# Altium schematic sheet Output.SchDoc
size B
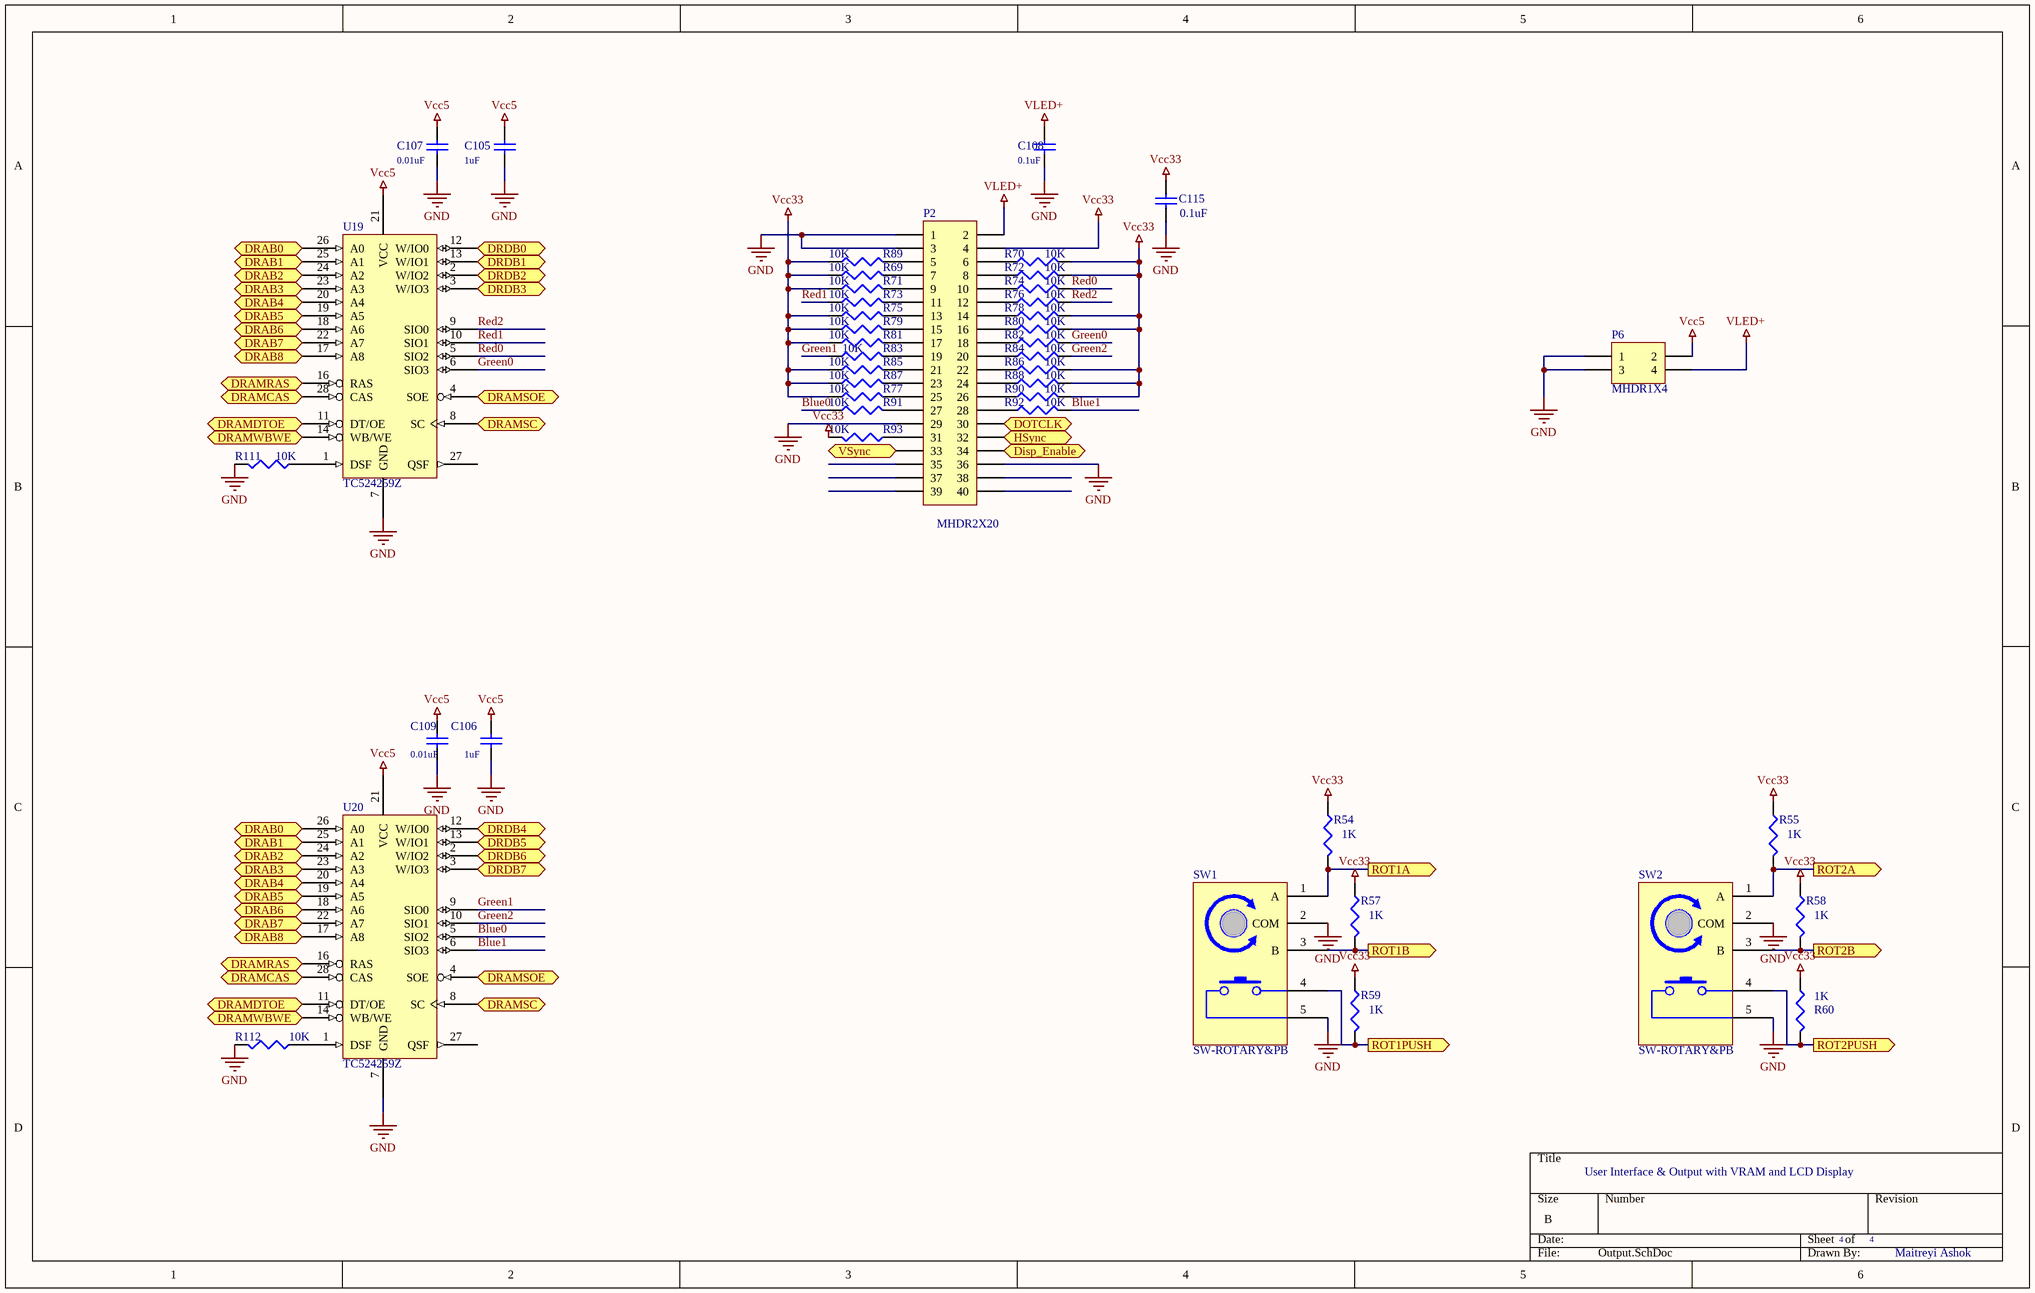
[diagram p0: Output.SchDoc]

## Parts
C105  value 1uF  [1608[0603]]  (hidden comment: Cap)
C106  value 1uF  [1608[0603]]  (hidden comment: Cap)
C107  value 0.01uF  [1608[0603]]  (hidden comment: Cap)
C108  value 0.1uF  [1608[0603]]  (hidden comment: Cap)
C109  value 0.01uF  [1608[0603]]  (hidden comment: Cap)
C115  value 0.1uF  [1608[0603]]  (hidden comment: Cap)
P2  MHDR2X20  [40PinZIF]
P6  MHDR1X4  [MDIN4]
R54  value 1K  [J1-0603]  (hidden comment: Res3)
R55  value 1K  [J1-0603]  (hidden comment: Res3)
R57  value 1K  [J1-0603]  (hidden comment: Res3)
R58  value 1K  [J1-0603]  (hidden comment: Res3)
R59  value 1K  [J1-0603]  (hidden comment: Res3)
R60  value 1K  [J1-0603]  (hidden comment: Res3)
R69  value 10K  [J1-0603]  (hidden comment: Res3)
R70  value 10K  [J1-0603]  (hidden comment: Res3)
R71  value 10K  [J1-0603]  (hidden comment: Res3)
R72  value 10K  [J1-0603]  (hidden comment: Res3)
R73  value 10K  [J1-0603]  (hidden comment: Res3)
R74  value 10K  [J1-0603]  (hidden comment: Res3)
R75  value 10K  [J1-0603]  (hidden comment: Res3)
R76  value 10K  [J1-0603]  (hidden comment: Res3)
R77  value 10K  [J1-0603]  (hidden comment: Res3)
R78  value 10K  [J1-0603]  (hidden comment: Res3)
R79  value 10K  [J1-0603]  (hidden comment: Res3)
R80  value 10K  [J1-0603]  (hidden comment: Res3)
R81  value 10K  [J1-0603]  (hidden comment: Res3)
R82  value 10K  [J1-0603]  (hidden comment: Res3)
R83  value 10K  [J1-0603]  (hidden comment: Res3)
R84  value 10K  [J1-0603]  (hidden comment: Res3)
R85  value 10K  [J1-0603]  (hidden comment: Res3)
R86  value 10K  [J1-0603]  (hidden comment: Res3)
R87  value 10K  [J1-0603]  (hidden comment: Res3)
R88  value 10K  [J1-0603]  (hidden comment: Res3)
R89  value 10K  [J1-0603]  (hidden comment: Res3)
R90  value 10K  [J1-0603]  (hidden comment: Res3)
R91  value 10K  [J1-0603]  (hidden comment: Res3)
R92  value 10K  [J1-0603]  (hidden comment: Res3)
R93  value 10K  [J1-0603]  (hidden comment: Res3)
R111  value 10K  [J1-0603]  (hidden comment: Res3)
R112  value 10K  [J1-0603]  (hidden comment: Res3)
SW1  SW-ROTARY&PB  [ROTENCPB]
SW2  SW-ROTARY&PB  [ROTENCPB]
U19  TC524259Z  [ZIPS28]
U20  TC524259Z  [ZIPS28]

## Ports
Disp_Enable (in), DOTCLK (in), DRAB0 (in), DRAB1 (in), DRAB2 (in), DRAB3 (in), DRAB4 (in), DRAB5 (in), DRAB6 (in), DRAB7 (in), DRAB8 (in), DRAMCAS (in), DRAMDTOE (in), DRAMRAS (in), DRAMSC (in), DRAMSOE (in), DRAMWBWE (in), DRDB0 (bidir), DRDB1 (bidir), DRDB2 (bidir), DRDB3 (bidir), DRDB4 (bidir), DRDB5 (bidir), DRDB6 (bidir), DRDB7 (bidir), HSync (in), ROT1A (out), ROT1B (out), ROT1PUSH (out), ROT2A (out), ROT2B (out), ROT2PUSH (out), VSync (in)

## Nets
GND: C105.1 C106.1 C107.1 C108.1 C109.1 C115.1 P2.1 P2.3 P2.29 P2.36 P6.1 P6.3 R111.2 R112.2 SW1.2(COM) SW1.5 SW2.2(COM) SW2.5 U19.7(GND) U20.7(GND)
VCC: C105.2 C106.2 C107.2 C109.2 P6.2 U19.21(VCC) U20.21(VCC)  [also labelled Vcc5]
Vcc33: C115.2 P2.4 R54.1 R55.1 R57.1 R58.1 R59.1 R60.1 R69.1 R70.2 R71.1 R72.2 R75.1 R77.1 R78.2 R79.1 R80.2 R81.1 R85.1 R86.2 R87.1 R88.2 R89.1 R90.2 R93.2
VLED+: C108.2 P2.2 P6.4
Blue0: R91.1 U20.5(SIO2)
Blue1: R92.2 U20.6(SIO3)
Disp_Enable: P2.34 ; port Disp_Enable
DOTCLK: P2.30 ; port DOTCLK
DRAB0: U19.26(A0) U20.26(A0) ; port DRAB0
DRAB1: U19.25(A1) U20.25(A1) ; port DRAB1
DRAB2: U19.24(A2) U20.24(A2) ; port DRAB2
DRAB3: U19.23(A3) U20.23(A3) ; port DRAB3
DRAB4: U19.20(A4) U20.20(A4) ; port DRAB4
DRAB5: U19.19(A5) U20.19(A5) ; port DRAB5
DRAB6: U19.18(A6) U20.18(A6) ; port DRAB6
DRAB7: U19.22(A7) U20.22(A7) ; port DRAB7
DRAB8: U19.17(A8) U20.17(A8) ; port DRAB8
DRAMCAS: U19.28(CAS) U20.28(CAS) ; port DRAMCAS
DRAMDTOE: U19.11(DT/OE) U20.11(DT/OE) ; port DRAMDTOE
DRAMRAS: U19.16(RAS) U20.16(RAS) ; port DRAMRAS
DRAMSC: U19.8(SC) U20.8(SC) ; port DRAMSC
DRAMSOE: U19.4(SOE) U20.4(SOE) ; port DRAMSOE
DRAMWBWE: U19.14(WB/WE) U20.14(WB/WE) ; port DRAMWBWE
DRDB0: U19.12(W/IO0) ; port DRDB0
DRDB1: U19.13(W/IO1) ; port DRDB1
DRDB2: U19.2(W/IO2) ; port DRDB2
DRDB3: U19.3(W/IO3) ; port DRDB3
DRDB4: U20.12(W/IO0) ; port DRDB4
DRDB5: U20.13(W/IO1) ; port DRDB5
DRDB6: U20.2(W/IO2) ; port DRDB6
DRDB7: U20.3(W/IO3) ; port DRDB7
Green0: R82.2 U19.6(SIO3)
Green1: R83.1 U20.9(SIO0)
Green2: R84.2 U20.10(SIO1)
HSync: P2.32 ; port HSync
Red0: R74.2 U19.5(SIO2)
Red1: R73.1 U19.10(SIO1)
Red2: R76.2 U19.9(SIO0)
ROT1A: R54.2 SW1.1(A) ; port ROT1A
ROT1B: R57.2 SW1.3(B) ; port ROT1B
ROT1PUSH: R59.2 SW1.4 ; port ROT1PUSH
ROT2A: R55.2 SW2.1(A) ; port ROT2A
ROT2B: R58.2 SW2.3(B) ; port ROT2B
ROT2PUSH: R60.2 SW2.4 ; port ROT2PUSH
VSync: P2.33 ; port VSync
NetP2_5: P2.5 R89.2
NetP2_6: P2.6 R70.1
NetP2_7: P2.7 R69.2
NetP2_8: P2.8 R72.1
NetP2_9: P2.9 R71.2
NetP2_10: P2.10 R74.1
NetP2_11: P2.11 R73.2
NetP2_12: P2.12 R76.1
NetP2_13: P2.13 R75.2
NetP2_14: P2.14 R78.1
NetP2_15: P2.15 R79.2
NetP2_16: P2.16 R80.1
NetP2_17: P2.17 R81.2
NetP2_18: P2.18 R82.1
NetP2_19: P2.19 R83.2
NetP2_20: P2.20 R84.1
NetP2_21: P2.21 R85.2
NetP2_22: P2.22 R86.1
NetP2_23: P2.23 R87.2
NetP2_24: P2.24 R88.1
NetP2_25: P2.25 R77.2
NetP2_26: P2.26 R90.1
NetP2_27: P2.27 R91.2
NetP2_28: P2.28 R92.1
NetP2_31: P2.31 R93.1
NetR111_1: R111.1 U19.1(DSF)
NetR112_1: R112.1 U20.1(DSF)

Not connected (* = marked no-connect by the designer): P2 35 37 38 39 40; U19 27(QSF); U20 27(QSF)

## Notes on the sheet
- User Interface & Output with VRAM and LCD Display
- 4             4
- Maitreyi Ashok

## Library data of the parts
C105-C109 C115 = Cap: Capacitor; Published: 8-Jun-2000; LatestRevisionDate: 17-Jul-2002; LatestRevisionNote: Re-released for DXP Platform.; PackageReference: RAD-0.3; Publisher: Altium Limited; PackageDescription: Radial Cap, Thru-Hole; 2 Leads; 0.3 in Pin Spacing
P2 = MHDR2X20: Header, 20-Pin, Dual row; LatestRevisionDate: 17-Jul-2002; LatestRevisionNote: Re-released for DXP Platform.; Publisher: Altium Limited
P6 = Header 2X2: Header, 2-Pin, Dual row; LatestRevisionDate: 17-Jul-2002; LatestRevisionNote: Re-released for DXP Platform.; Publisher: Altium Limited
R54 R55 R57-R60 R69-R93 R111 R112 = Res3: Resistor; Published: 8-Jun-2000; LatestRevisionDate: 29-May-2009; LatestRevisionNote: IPC-7351 Footprint Added.; PackageReference: J1-0603; Publisher: Altium Limited; PackageDescription: Chip Resistor
SW1 SW2 = SW-ROTARY&PB: Rotary Encoder with Built-In Push Button
U19 U20 = TC524259Z: CMOS 262,144 Words x 4-Bits Multiport DRAM